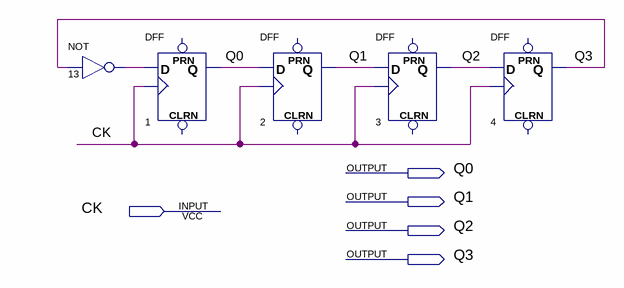
[diagram p0: schematic sheet]
// Quartus schematic 8_MOD_Johnson_D.bdf as structural Verilog: 5 symbols, 5 pins
module \8_MOD_Johnson_D  (
  input  CK,
  output Q0,
  output Q1,
  output Q2,
  output Q3
);

  wire n13_out;

  not u_13 (n13_out, Q3);
  DFF u_1 (.CLK(CK), .D(n13_out), .Q(Q0));  // open: CLRN, PRN
  DFF u_2 (.CLK(CK), .D(Q0), .Q(Q1));  // open: CLRN, PRN
  DFF u_3 (.CLK(CK), .D(Q1), .Q(Q2));  // open: CLRN, PRN
  DFF u_4 (.CLK(CK), .D(Q2), .Q(Q3));  // open: CLRN, PRN
endmodule
